# EAGLE design eurorack-passive-switches (EAGLE 9.6.2)
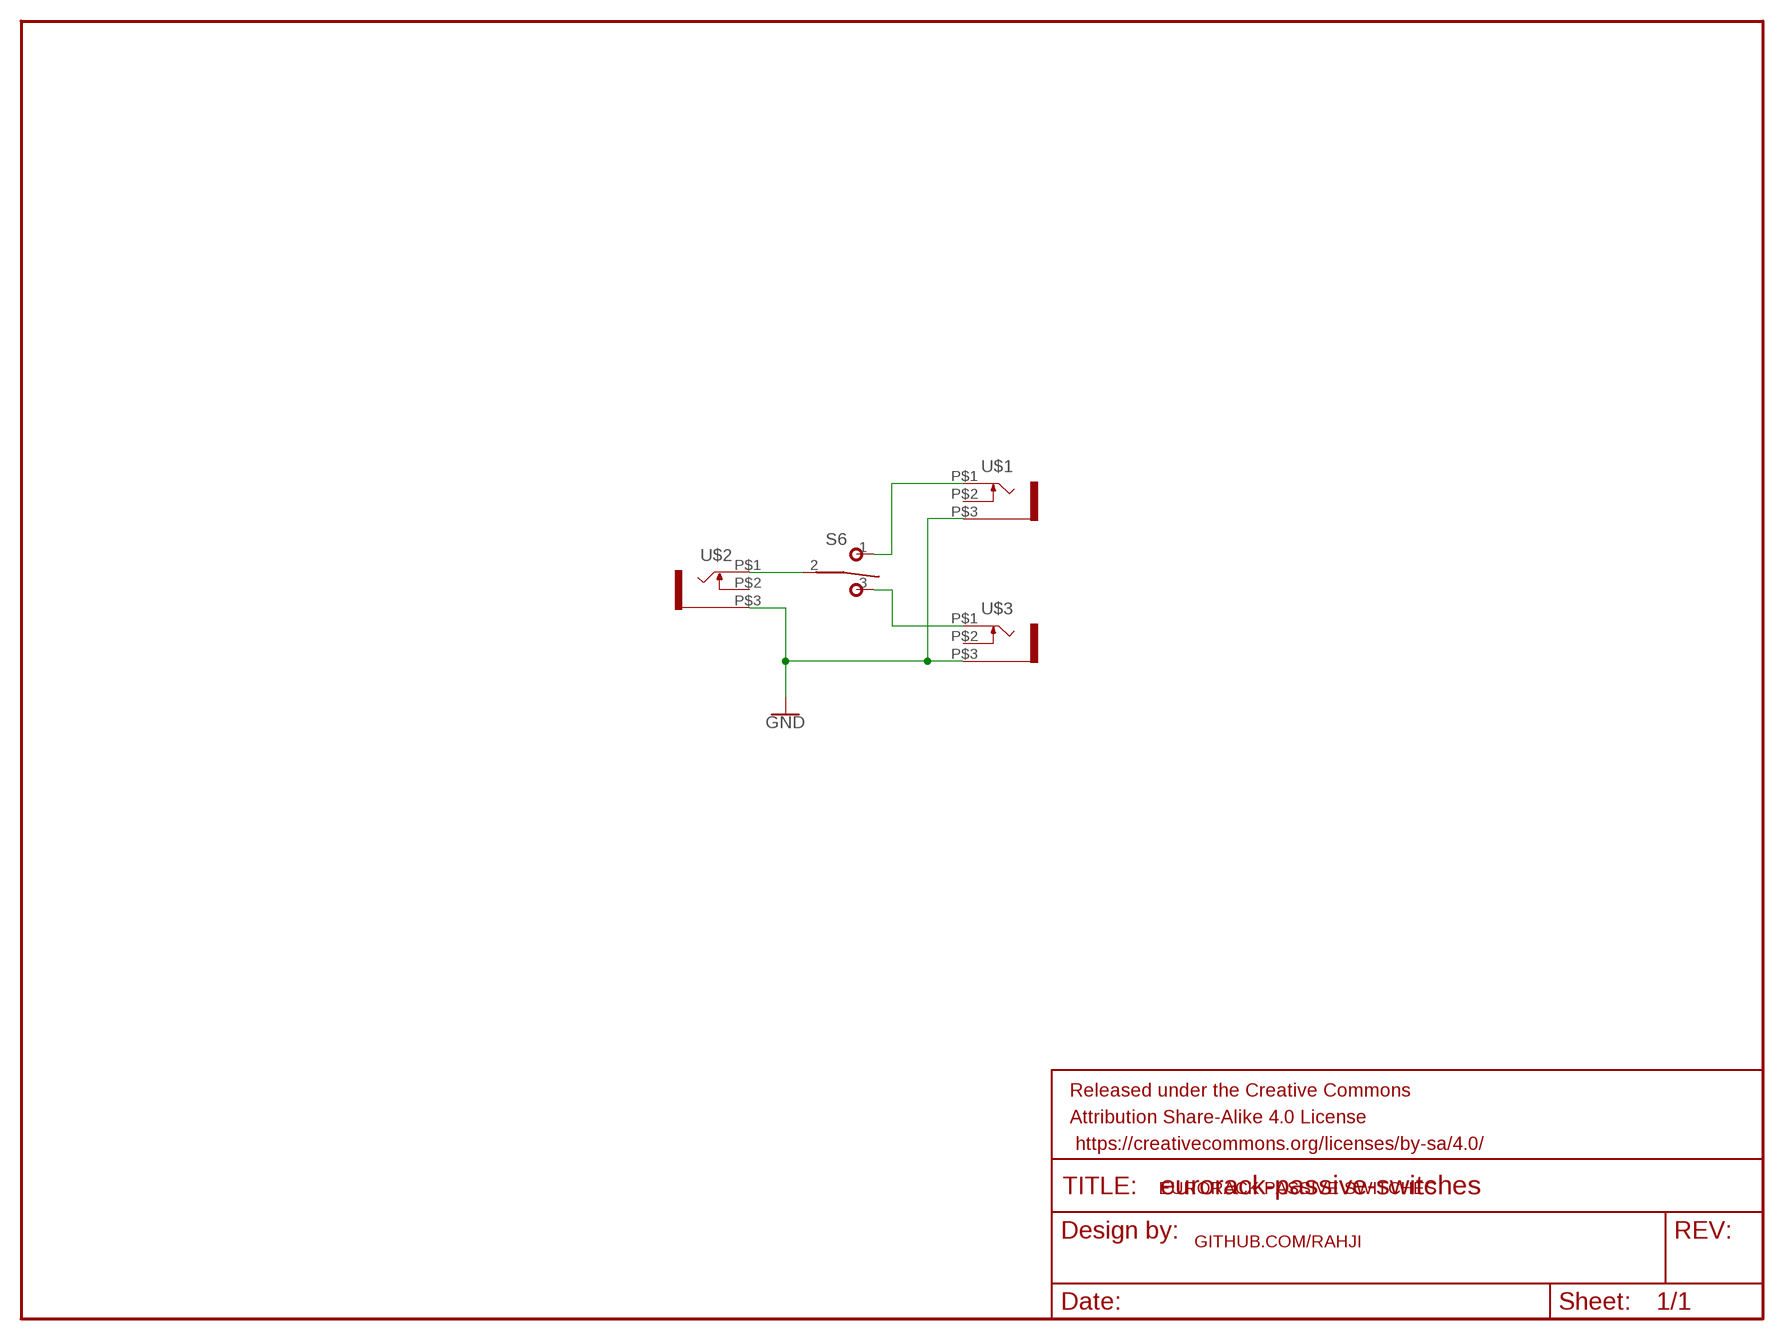
[diagram p0: schematic, sheet 1]

## Parts
FRAME1  FRAME-LETTERNO_PACKAGE  [DUMMY]
S6  SPDT  [M9040P]
U$1  OUT  WQP-PJ301M-12_JACK  [WQP-PJ301M-12_JACK]
U$2  IN  WQP-PJ301M-12_JACK  [WQP-PJ301M-12_JACK]
U$3  OUT  WQP-PJ301M-12_JACK  [WQP-PJ301M-12_JACK]

## Nets
GND: U$1.P$3 U$2.P$3 U$3.P$3
N$1: S6.2(P) U$2.P$1
N$2: S6.1(O) U$1.P$1
N$3: S6.3(S) U$3.P$1
Unconnected: U$1.P$2 U$2.P$2 U$3.P$2

## Notes on the sheet
- EURORACK PASSIVE SWITCHES
- GITHUB.COM/RAHJI

## Library data of the parts
FRAME1 = SparkFun-Aesthetics:FRAME-LETTER: Schematic Frame - Letter Standard 8.5x11 US Letter frame; DESIGNER: Nobody; VERSION: v01
S6 = TomW:SPDT: TOGGLE SWITCH Marquardt
U$1-U$3 = thonkiconn:WQP-PJ301M-12_JACK

## Board
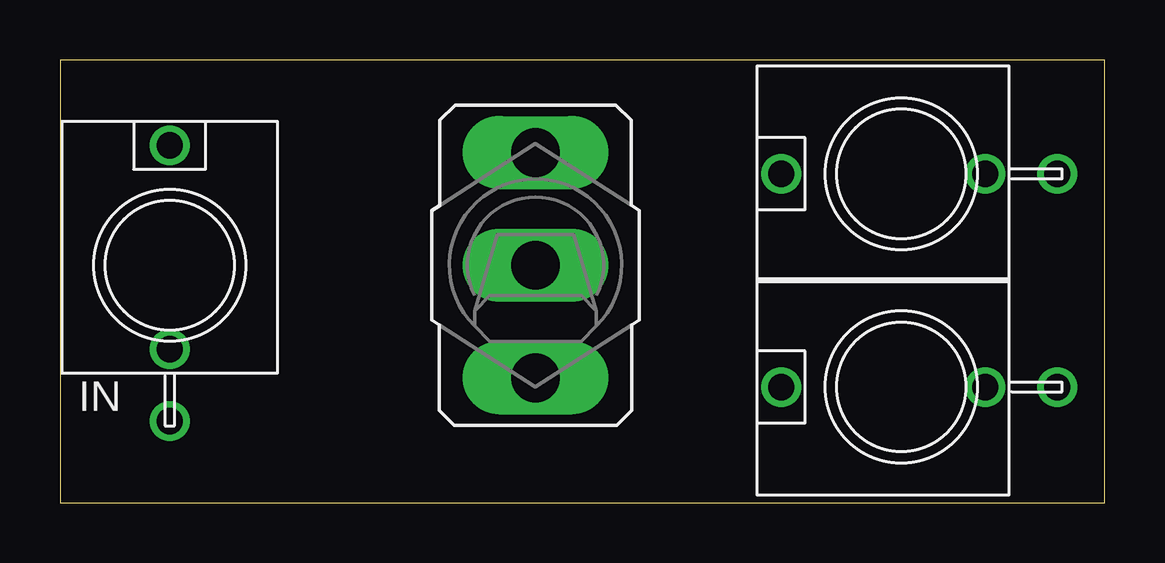
[diagram p1: board, top side]
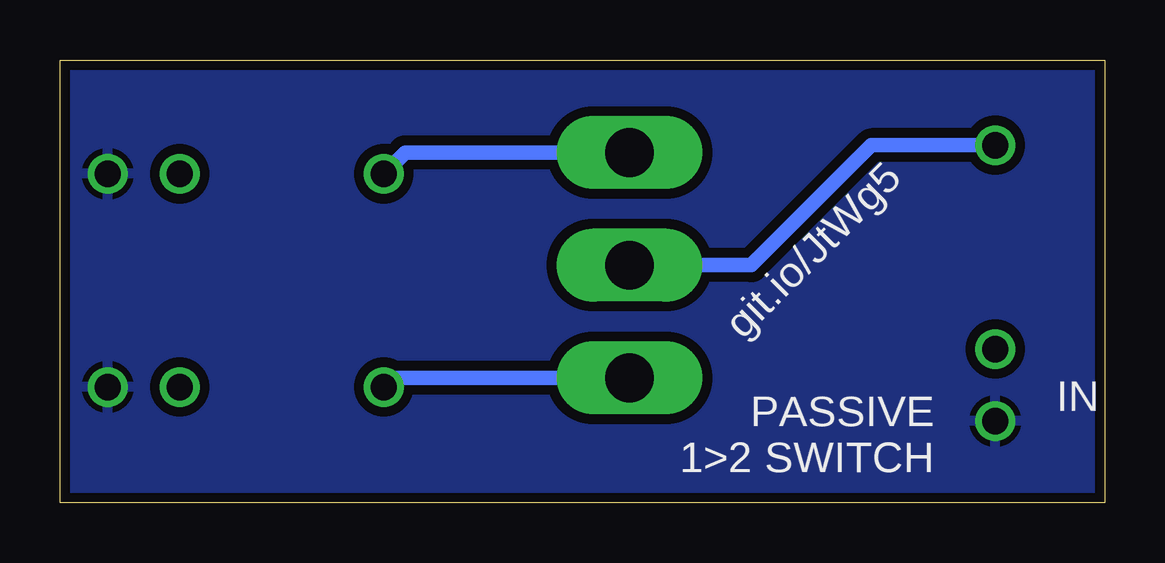
[diagram p2: board, bottom side, seen from below]

Size 43.54 x 18.47 mm. Coordinates in mm from the lower left corner, seen from the top.
Outline: 0,0 43.54,0 43.54,18.47 0,18.47 0,0
Copper layers (1*16): Top 0.0356mm / dielectric 1.5011mm / Bottom 0.0356mm
Design rules "oshpark-2layer": minimum track width 6mil, minimum drill 13mil, track to track 6mil, track to pad 6mil, pad to pad 6mil, via to via 6mil, smd to smd 6mil, copper to edge 15mil, drill to drill 6mil, minimum pad ring 7mil, minimum via ring 7mil, stop-mask expansion 2.5mil, vias tented up to drill 0mil, thermal gap 10mil

### Footprints (pad centres in the part's own frame; a part is rotated, then mirrored left to right if it is on the bottom)
M9040P = drill 2.03 long: 1 0,4.699; 2 0,0; 3 0,-4.699
WQP-PJ301M-12_JACK = drill 1.1: P$1 0,5; P$2 0,-3.5; P$3 0,-6.5

### Placement (x,y rotation side)
FRAME1  -1.78,-2.79 0 top
S6  19.81,9.91 0 top
U$1  35.05,13.72 90 top
U$2  4.57,9.91 0 top
U$3  35.05,4.83 90 top

### Tracks (layer width: path | path; a pad name or v marks a point on that pad's centre or on a via)
GND
  pour Bottom (isolate 0.406): -1.78,20.07 45.21,20.07 45.21,-1.52 -1.78,-1.52
N$1
  Bottom 0.61: U$2.P$1 9.73,14.91 14.73,9.91 S6.2
N$2
  Bottom 0.61: S6.1 29.16,14.61 U$1.P$1
N$3
  Bottom 0.61: S6.3 29.67,5.21 U$3.P$1

### Text on the board
tNames: IN
bNames: git.io/JtWg5 | IN | PASSIVE / 1>2 SWITCH